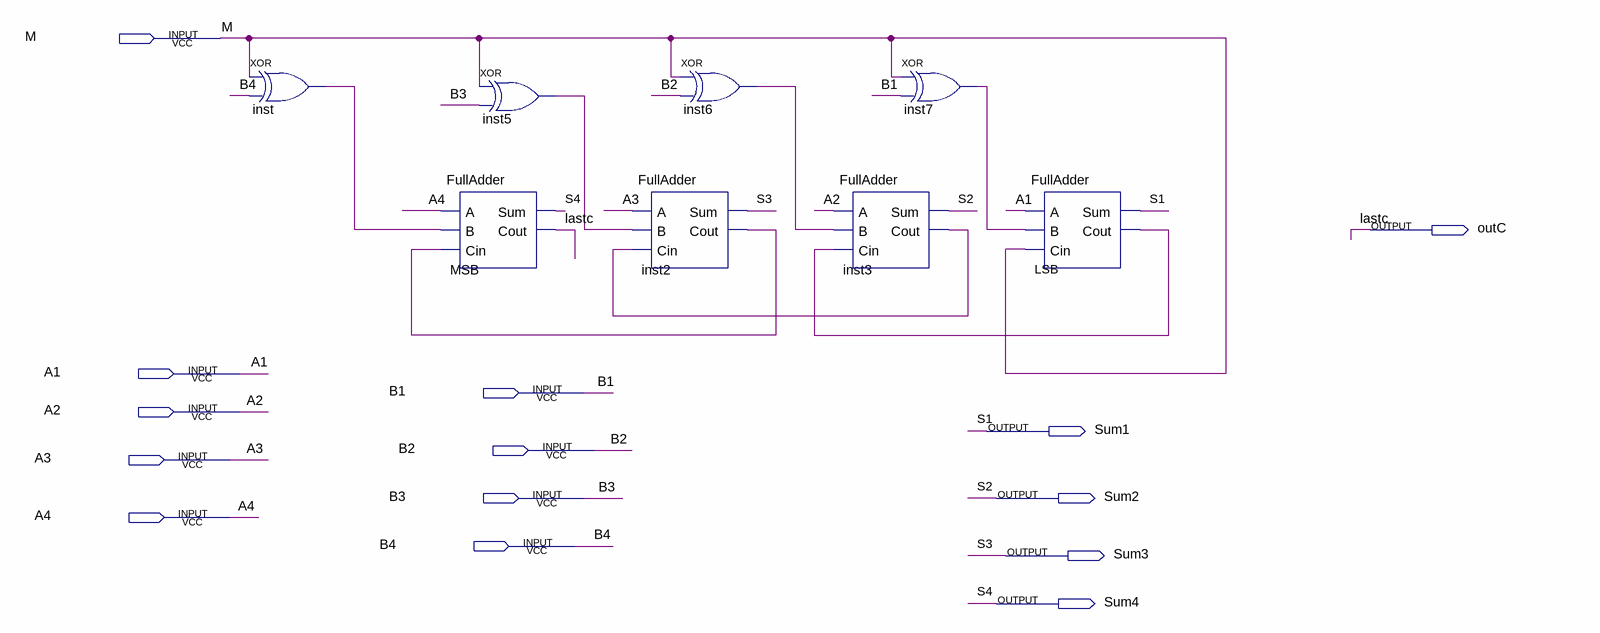
[diagram p0: schematic sheet]
// Quartus schematic Ripple.bdf as structural Verilog: 8 symbols, 14 pins
module Ripple (
  input  M,
  input  A1,
  input  B1,
  input  A2,
  input  B2,
  input  A3,
  input  B3,
  input  A4,
  input  B4,
  output outC,
  output Sum1,
  output Sum2,
  output Sum3,
  output Sum4
);

  wire inst2_cout, inst3_cout, inst5_out, inst6_out, inst7_out, inst_out, LSB_cout;

  xor inst (inst_out, M, B4);
  FullAdder MSB (.A(A4), .B(inst_out), .Cin(inst2_cout), .Sum(Sum4), .Cout(outC));
  xor inst5 (inst5_out, M, B3);
  xor inst6 (inst6_out, M, B2);
  FullAdder inst2 (.A(A3), .B(inst5_out), .Cin(inst3_cout), .Sum(Sum3), .Cout(inst2_cout));
  FullAdder inst3 (.A(A2), .B(inst6_out), .Cin(LSB_cout), .Sum(Sum2), .Cout(inst3_cout));
  xor inst7 (inst7_out, M, B1);
  FullAdder LSB (.A(A1), .B(inst7_out), .Cin(M), .Sum(Sum1), .Cout(LSB_cout));

  // Other names for the same wires on the sheet: lastc = outC; S1 = Sum1; S2 = Sum2; S3 = Sum3; S4 = Sum4
endmodule
